# Altium schematic sheet Power1.SchDoc (part 2 of 2)
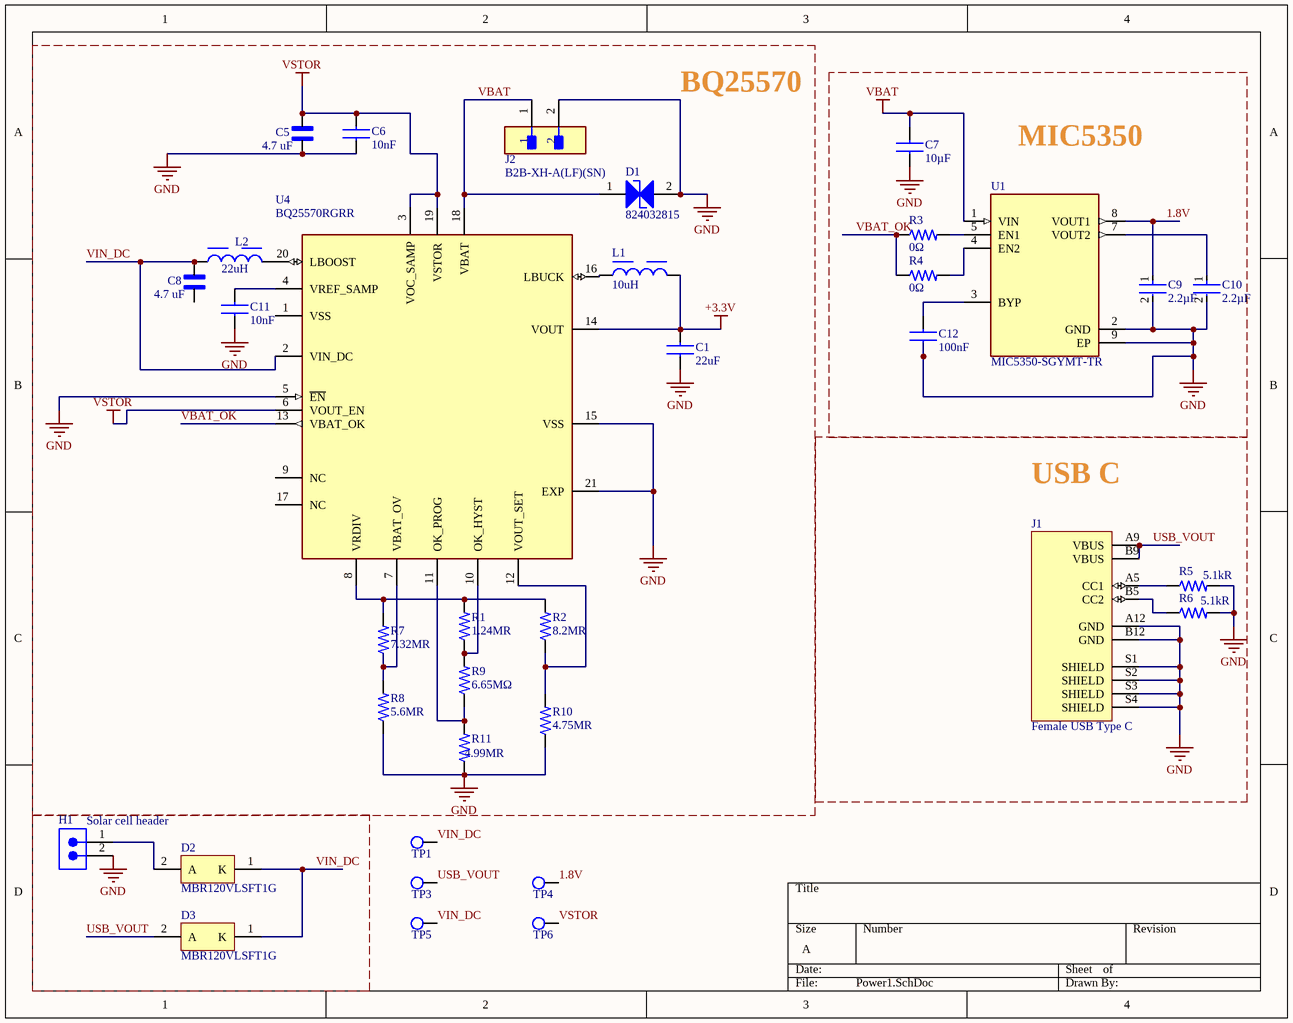
[diagram p1: Power1.SchDoc]

## Library data of the parts
C1 = GRM188R61A226ME15D: CAP CER 22UF 10V X5R 0603; Manufacturer: Murata; Voltage Rating DC: 10 VDC; Tolerance: 20 %; Brand: Murata Electronics; Type: Voltage and Temperature Derating Recommended Product; Unit Weight: 0.000222 oz; Supplier 1: Digi-Key; Supplier Part Number 1: 490-10476-1-ND; Manufacturer Part Number: GRM188R61A226ME15D; Stock 1: 849458; Pricing 1: 1=0.33, 10=0.226, 50=0.1506, 100=0.1279, 500=0.0903, 1000=0.079 (USD); Product Category: Multilayer Ceramic Capacitors MLCC - SMD/SMT; RoHS: True; Capacitance: 22 uF; Dielectric: X5R; Case Code - in: 0603; Case Code - mm: 1608; Height: 0.8 mm; Maximum Operating Temperature: + 85 C; Minimum Operating Temperature: - 55 C; Product: General Type MLCCs; Series: GRM; Packaging: Reel; Length: 1.6 mm; Package / Case: 0603 (1608 metric); Factory Pack Quantity: 4000; Termination Style: SMD/SMT; Width: 0.8 mm; ComponentLink1URL: http://www.farnell.com/datasheets/2047978.pdf?src-supplier=Element14; ComponentLink1Description: http://www.farnell.com/datasheets/2047978.pdf?src-supplier=Element14
C5 C8 = CL10A475KO8NNNC: 4.7 ÂµF Â±10% 16V Ceramic Capacitor X5R 0603 (1608 Metric); MF: Samsung Electro-Mechanics; SnapEDA_Link: https://www.snapeda.com/parts/CL10A475KO8NNNC/Samsung/view-part/?ref=snap; Package: SMD-2 Samsung; Value: *; MP: CL10A475KO8NNNC; Check_prices: https://www.snapeda.com/parts/CL10A475KO8NNNC/Samsung/view-part/?ref=eda
C6 C11 = CAP 10nF 0603: Multilayer Ceramic Capacitors MLCC - SMD/SMT 16V 0.01uF X7R 0603 10% AEC-Q200; Manufacturer: KEMET; Manufacturer Part Number: C0603C103K4RECAUTO; Supplier: Newark; Supplier Part Number: 76AH8427; RoHS: Compliant; Category: Ceramic Capacitors; Stock: 3130; Pricing: 1=0.02, 25=0.02, 50=0.02, 100=0.02, 250=0.02, 500=0.02, 1000=0.02 (USD); China RoHS: Compliant; Dielectric: X7R; Dielectric Material: Ceramic; Height: 800µm; Length: 1.6mm; Lifecycle Status: Production; Max Operating Temperature: 125°C; Min Operating Temperature: -55°C; Mounting Technology: Surface Mount; Number of Terminals: 2; REACH SVHC: Yes; Schedule B: 8532240020, 8532240020|8532240020, 8532240020|8532240020|8532240020, 8532240020|8532240020|8532240020|8532240020; Voltage Rating (DC): 16V; Width: 800µm; ComponentLink1URL: https://datasheet.octopart.com:443/C0603C103K4RECAUTO-KEMET-datasheet-178568699.pdf?src-supplier=IHS; ComponentLink1Description: https://datasheet.octopart.com:443/C0603C103K4RECAUTO-KEMET-datasheet-178568699.pdf?src-supplier=IHS; ComponentLink2URL: https://datasheet.octopart.com:443/C0603C103K4RECAUTO-KEMET-datasheet-189767465.pdf?src-supplier=ODG+(Origin+Data+Global); ComponentLink2Description: https://datasheet.octopart.com:443/C0603C103K4RECAUTO-KEMET-datasheet-189767465.pdf?src-supplier=ODG+(Origin+Data+Global); ComponentLink3URL: https://datasheet.octopart.com:443/C0603C103K4RECAUTO-KEMET-datasheet-149521825.pdf?src-supplier=Farnell; ComponentLink3Description: https://datasheet.octopart.com:443/C0603C103K4RECAUTO-KEMET-datasheet-149521825.pdf?src-supplier=Farnell; ComponentLink4URL: https://datasheet.octopart.com:443/C0603C103K4RECAUTO-KEMET-datasheet-153706760.pdf?src-supplier=Farnell; ComponentLink4Description: https://datasheet.octopart.com:443/C0603C103K4RECAUTO-KEMET-datasheet-153706760.pdf?src-supplier=Farnell; ComponentLink5URL: https://datasheet.octopart.com:443/C0603C103K4RECAUTO-KEMET-datasheet-153410967.pdf?src-supplier=Electro+Sonic; ComponentLink5Description: https://datasheet.octopart.com:443/C0603C103K4RECAUTO-KEMET-datasheet-153410967.pdf?src-supplier=Electro+Sonic; ComponentLink6URL: https://datasheet.octopart.com:443/C0603C103K4RECAUTO-KEMET-datasheet-176334325.pdf?src-supplier=Newark; ComponentLink6Description: https://datasheet.octopart.com:443/C0603C103K4RECAUTO-KEMET-datasheet-176334325.pdf?src-supplier=Newark; ComponentLink7URL: https://datasheet.octopart.com:443/C0603C103K4RECAUTO-KEMET-datasheet-158241778.pdf?src-supplier=TME; ComponentLink7Description: https://datasheet.octopart.com:443/C0603C103K4RECAUTO-KEMET-datasheet-158241778.pdf?src-supplier=TME; Supplier 1: DigiKey; Supplier Part Number 1: 399-17880-1-ND
C7 = CAP 10uF 0603: 10V 10uF X7R ±10% 0603 Multilayer Ceramic Capacitors MLCC - SMD/SMT ROHS; Manufacturer: Murata; Manufacturer Part Number: GRM188Z71A106KA73D; Manufacturer Lifecycle Status: IN PRODUCTION; Supplier: Avnet; Supplier Part Number: GRM188Z71A106KA73D; RoHS: Compliant; Category: Ceramic Capacitors; Stock: 36000; Pricing: 4000=0.04684, 8000=0.04661, 16000=0.04637, 24000=0.04613, 32000=0.04589 (USD); Case/Package: 0603; Dielectric Material: Ceramic; Height: 800µm; Length: 1.6mm; Lifecycle Status: Production; Material: Ceramic; Max Operating Temperature: 125°C; Min Operating Temperature: -55°C; Mounting Technology: Surface Mount; Number of Terminals: 2; REACH SVHC: Yes; Schedule B: 8532240020, 8532240020|8532240020|8532240020|8532240020|8532240020; Thickness: 800µm; Tolerance: 10%; Voltage Rating: 10V; Voltage Rating (DC): 10V; Width: 800µm; ComponentLink1URL: https://datasheet.octopart.com:443/GRM188Z71A106KA73D-Murata-datasheet-141276001.pdf?src-supplier=Geoflip; ComponentLink1Description: https://datasheet.octopart.com:443/GRM188Z71A106KA73D-Murata-datasheet-141276001.pdf?src-supplier=Geoflip; ComponentLink2URL: https://datasheet.octopart.com:443/GRM188Z71A106KA73D-Murata-datasheet-165579666.pdf?src-supplier=TME; ComponentLink2Description: https://datasheet.octopart.com:443/GRM188Z71A106KA73D-Murata-datasheet-165579666.pdf?src-supplier=TME; ComponentLink3URL: https://datasheet.octopart.com:443/GRM188Z71A106KA73D-Murata-datasheet-140705911.pdf?src-supplier=Ciiva; ComponentLink3Description: https://datasheet.octopart.com:443/GRM188Z71A106KA73D-Murata-datasheet-140705911.pdf?src-supplier=Ciiva; ComponentLink4URL: https://datasheet.octopart.com:443/GRM188Z71A106KA73D-Murata-datasheet-138743429.pdf?src-supplier=Ciiva; ComponentLink4Description: https://datasheet.octopart.com:443/GRM188Z71A106KA73D-Murata-datasheet-138743429.pdf?src-supplier=Ciiva; ComponentLink5URL: http://sigma.octopart.com:80/reach_statement/Murata-company-16.pdf?src-supplier=Compliance+Statements; ComponentLink5Description: http://sigma.octopart.com:80/reach_statement/Murata-company-16.pdf?src-supplier=Compliance+Statements; Supplier 1: DigiKey; Supplier Part Number 1: 490-GRM188Z71A106KA73DCT-ND
C9 C10 = CAP 2.2uF 0603: 10V 2.2uF X7R ±10% 0603 Multilayer Ceramic Capacitors MLCC - SMD/SMT ROHS; Manufacturer: Samsung Electro-Mechanics; Manufacturer Part Number: CL10B225KP8NNNC; Supplier: DigiKey; Supplier Part Number: 1276-1134-1-ND; RoHS: Compliant; Category: Ceramic Capacitors; Stock: 3647; Pricing: 1=0.08, 10=0.047, 50=0.0376, 100=0.028, 500=0.0224, 1000=0.02, 4000=0.0104 (USD); Case/Package: 0603; Case Code (Imperial): 0603; Case Code (Metric): 1608; China RoHS: Compliant; Contact Plating: Tin; Depth: 800µm; Dielectric: X7R; Dielectric Material: Ceramic; Height: 900µm; Length: 1.6mm; Lifecycle Status: Production; Material: Ceramic; Max Operating Temperature: 125°C; Min Operating Temperature: -55°C; Mounting Technology: Surface Mount; Number of Terminals: 2; Radiation Hardening: No; REACH SVHC: Yes; Schedule B: 8532240020, 8532240020|8532240020, 8532240020|8532240020|8532240020, 8532240020|8532240020|8532240020|8532240020; Thickness: 889µm; Tolerance: 10%; Voltage Rating: 10V; Voltage Rating (DC): 10V; Width: 800µm; ComponentLink1URL: https://datasheet.octopart.com:443/CL10B225KP8NNNC-Samsung-Electro-Mechanics-datasheet-182020320.pdf?src-supplier=IHS; ComponentLink1Description: https://datasheet.octopart.com:443/CL10B225KP8NNNC-Samsung-Electro-Mechanics-datasheet-182020320.pdf?src-supplier=IHS; ComponentLink2URL: https://datasheet.octopart.com:443/CL10B225KP8NNNC-Samsung-Electro-Mechanics-datasheet-136482340.pdf?src-supplier=Future+Electronics; ComponentLink2Description: https://datasheet.octopart.com:443/CL10B225KP8NNNC-Samsung-Electro-Mechanics-datasheet-136482340.pdf?src-supplier=Future+Electronics; ComponentLink3URL: https://datasheet.octopart.com:443/CL10B225KP8NNNC-Samsung-Electro-Mechanics-datasheet-116120883.pdf?src-supplier=Future+Electronics; ComponentLink3Description: https://datasheet.octopart.com:443/CL10B225KP8NNNC-Samsung-Electro-Mechanics-datasheet-116120883.pdf?src-supplier=Future+Electronics; ComponentLink4URL: https://datasheet.octopart.com:443/CL10B225KP8NNNC-Samsung-Electro-Mechanics-datasheet-81461883.pdf?src-supplier=Future+Electronics; ComponentLink4Description: https://datasheet.octopart.com:443/CL10B225KP8NNNC-Samsung-Electro-Mechanics-datasheet-81461883.pdf?src-supplier=Future+Electronics; ComponentLink5URL: https://datasheet.octopart.com:443/CL10B225KP8NNNC-Samsung-datasheet-26669043.pdf?src-supplier=Future+Electronics; ComponentLink5Description: https://datasheet.octopart.com:443/CL10B225KP8NNNC-Samsung-datasheet-26669043.pdf?src-supplier=Future+Electronics; ComponentLink6URL: https://datasheet.octopart.com:443/CL10B225KP8NNNC-Samsung-datasheet-12521702.pdf?src-supplier=Future+Electronics; ComponentLink6Description: https://datasheet.octopart.com:443/CL10B225KP8NNNC-Samsung-datasheet-12521702.pdf?src-supplier=Future+Electronics; ComponentLink7URL: https://datasheet.octopart.com:443/CL10B225KP8NNNC-Samsung-Electro-Mechanics-datasheet-149136832.pdf?src-supplier=Future+Electronics; ComponentLink7Description: https://datasheet.octopart.com:443/CL10B225KP8NNNC-Samsung-Electro-Mechanics-datasheet-149136832.pdf?src-supplier=Future+Electronics; ComponentLink8URL: https://datasheet.octopart.com:443/CL10B225KP8NNNC-Samsung-datasheet-37081328.pdf?src-supplier=Future+Electronics; ComponentLink8Description: https://datasheet.octopart.com:443/CL10B225KP8NNNC-Samsung-datasheet-37081328.pdf?src-supplier=Future+Electronics; ComponentLink9URL: https://datasheet.octopart.com/CL10B225KP8NNNC-Samsung-Electro-Mechanics-datasheet-97040617.pdf; ComponentLink9Description: https://datasheet.octopart.com/CL10B225KP8NNNC-Samsung-Electro-Mechanics-datasheet-97040617.pdf; ComponentLink10URL: https://datasheet.octopart.com/CL10B225KP8NNNC-Samsung-Electro-Mechanics-datasheet-8324245.pdf; ComponentLink10Description: https://datasheet.octopart.com/CL10B225KP8NNNC-Samsung-Electro-Mechanics-datasheet-8324245.pdf; ComponentLink11URL: https://datasheet.octopart.com:443/CL10B225KP8NNNC-Samsung-Electro-Mechanics-datasheet-11840088.pdf?src-supplier=Arrow+Electronics; ComponentLink11Description: https://datasheet.octopart.com:443/CL10B225KP8NNNC-Samsung-Electro-Mechanics-datasheet-11840088.pdf?src-supplier=Arrow+Electronics; ComponentLink12URL: https://datasheet.octopart.com:443/CL10B225KP8NNNC-Samsung-datasheet-59220082.pdf?src-supplier=TME; ComponentLink12Description: https://datasheet.octopart.com:443/CL10B225KP8NNNC-Samsung-datasheet-59220082.pdf?src-supplier=TME; Supplier 1: DigiKey; Supplier Part Number 1: 1276-1134-1-ND
C12 = CAP 0.1uF 0603: 0603 0.1 uF 10 V ±10% Tolerance X7R SMT Multilayer Ceramic Chip Capacitor; Manufacturer: Vishay; Manufacturer Part Number: VJ0603Y104KXQCW1BC; Voltage Rating (DC): 10V; Supplier: Newark; Supplier Part Number: 77AK2911; RoHS: Compliant; Category: Ceramic Capacitors; Stock: 20000; Pricing: 4000=0.028, 8000=0.026 (USD); Case/Package: 0603; Case Code (Imperial): 0603; Case Code (Metric): 1608; China RoHS: Compliant; Depth: 800µm; Dielectric: X7R; Dielectric Material: Ceramic; Height: 870µm; Lead Free: Lead Free; Length: 1.6mm; Lifecycle Status: Production; Max Operating Temperature: 125°C; Min Operating Temperature: -55°C; Mounting Technology: Surface Mount; Number of Terminals: 2; REACH SVHC: Yes; Schedule B: 8532240020, 8532240020|8532240020|8532240020|8532240020|8532240020; Termination: SMD/SMT; Tolerance: 10%; Width: 800µm; ComponentLink1URL: https://datasheet.octopart.com:443/VJ0603Y104KXQCW1BC-Vishay-datasheet-182138897.pdf?src-supplier=IHS; ComponentLink1Description: https://datasheet.octopart.com:443/VJ0603Y104KXQCW1BC-Vishay-datasheet-182138897.pdf?src-supplier=IHS; ComponentLink2URL: https://datasheet.octopart.com:443/VJ0603Y104KXQCW1BC-Vishay-datasheet-182137611.pdf?src-supplier=IHS; ComponentLink2Description: https://datasheet.octopart.com:443/VJ0603Y104KXQCW1BC-Vishay-datasheet-182137611.pdf?src-supplier=IHS; ComponentLink3URL: https://datasheet.octopart.com:443/VJ0603Y104KXQCW1BC-Vishay-datasheet-79783898.pdf?src-supplier=Future+Electronics; ComponentLink3Description: https://datasheet.octopart.com:443/VJ0603Y104KXQCW1BC-Vishay-datasheet-79783898.pdf?src-supplier=Future+Electronics; ComponentLink4URL: https://datasheet.octopart.com/VJ0603Y104KXQCW1BC-Vishay-datasheet-13530908.pdf; ComponentLink4Description: https://datasheet.octopart.com/VJ0603Y104KXQCW1BC-Vishay-datasheet-13530908.pdf; ComponentLink5URL: https://datasheet.octopart.com/VJ0603Y104KXQCW1BC-Vishay-datasheet-13436109.pdf; ComponentLink5Description: https://datasheet.octopart.com/VJ0603Y104KXQCW1BC-Vishay-datasheet-13436109.pdf; ComponentLink6URL: https://datasheet.octopart.com/VJ0603Y104KXQCW1BC-Vishay-datasheet-13168783.pdf; ComponentLink6Description: https://datasheet.octopart.com/VJ0603Y104KXQCW1BC-Vishay-datasheet-13168783.pdf; ComponentLink7URL: https://datasheet.octopart.com/VJ0603Y104KXQCW1BC-Vishay-datasheet-13134009.pdf; ComponentLink7Description: https://datasheet.octopart.com/VJ0603Y104KXQCW1BC-Vishay-datasheet-13134009.pdf; ComponentLink8URL: https://datasheet.octopart.com/VJ0603Y104KXQCW1BC-Vishay-datasheet-13055807.pdf; ComponentLink8Description: https://datasheet.octopart.com/VJ0603Y104KXQCW1BC-Vishay-datasheet-13055807.pdf; ComponentLink9URL: https://datasheet.octopart.com/VJ0603Y104KXQCW1BC-Vishay-datasheet-13029350.pdf; ComponentLink9Description: https://datasheet.octopart.com/VJ0603Y104KXQCW1BC-Vishay-datasheet-13029350.pdf; ComponentLink10URL: https://datasheet.octopart.com/VJ0603Y104KXQCW1BC-Vishay-datasheet-12584848.pdf; ComponentLink10Description: https://datasheet.octopart.com/VJ0603Y104KXQCW1BC-Vishay-datasheet-12584848.pdf; ComponentLink11URL: https://datasheet.octopart.com/VJ0603Y104KXQCW1BC-Vishay-datasheet-12543093.pdf; ComponentLink11Description: https://datasheet.octopart.com/VJ0603Y104KXQCW1BC-Vishay-datasheet-12543093.pdf; ComponentLink12URL: https://datasheet.octopart.com/VJ0603Y104KXQCW1BC-Vishay-datasheet-12532924.pdf; ComponentLink12Description: https://datasheet.octopart.com/VJ0603Y104KXQCW1BC-Vishay-datasheet-12532924.pdf; ComponentLink13URL: https://datasheet.octopart.com/VJ0603Y104KXQCW1BC-Vishay-datasheet-12519409.pdf; ComponentLink13Description: https://datasheet.octopart.com/VJ0603Y104KXQCW1BC-Vishay-datasheet-12519409.pdf; ComponentLink14URL: https://datasheet.octopart.com/VJ0603Y104KXQCW1BC-Vishay-datasheet-12509873.pdf; ComponentLink14Description: https://datasheet.octopart.com/VJ0603Y104KXQCW1BC-Vishay-datasheet-12509873.pdf; ComponentLink15URL: http://sigma.octopart.com:80/rohs_statement/Vishay-company-15.pdf?src-supplier=Compliance+Statements; ComponentLink15Description: http://sigma.octopart.com:80/rohs_statement/Vishay-company-15.pdf?src-supplier=Compliance+Statements; Supplier 1: DigiKey; Supplier Part Number 1: 720-1689-1-ND
D1 = TVS Diode ESD Protection: 824032815 Tvs Diode, Bidir, 5V, Dfn1610 Rohs Compliant: Yes |Wurth Elektronik 824032815; NexarPartId: 133963841; Min Operating Temperature: -55°C; Width: 1mm; Length: 1.6mm; RoHS: Compliant; Max Operating Temperature: 85°C; Height: 500µm
D2 D3 = Diode Schottky: Schottky Power Rectifier, 2-Pin SOD-123, Pb-Free, Tape and Reel; Manufacturer: On Semiconductor; IFSM Max (A): 45; Configuration: Single; PackageDescription: 2-Pin SOD, Body 1.65 x 2.7 mm; RoHS: TRUE; ComponentLink2URL: http://www.onsemi.cn/pub_link/Collateral/MBR120VLSFT1-D.PDF; Mounting Technology: Surface Mount; ComponentLink1Description: Manufacturer URL; DatasheetVersion: Rev. 2; ComponentLink3Description: Package Specification; Packing: Tape and Reel; ComponentLink2Description: Datasheet; ComponentLink1URL: http://www.onsemi.com/; PackageVersion: Rev. A; PackageReference: SOD-123FL-2-498-01; ComponentLink3URL: http://www.onsemi.cn/pub_link/Collateral/MBR120VLSFT1-D.PDF; PartNumber: MBR120VLSFT1G
H1 = SOLAR_CELL: CONN HEADER VERT 2POS 2.54MM; Manufacturer: Sullins; Manufacturer Part Number: PRPC002SAAN-RC; Connector Type: Header, Unshrouded, Breakaway; Number of Positions: 2; Number of Positions Loaded: All; Pitch: 0.100" (2.54mm); Online Catalog: 0.100" (2.54mm) Pitch Connector Headers; Other Names: S9510E-02  S9510E-02-ND; Supplier 1: Digi-Key; Stock 1: 42739; Pricing 1: 1=0.08, 10=0.073, 25=0.054, 50=0.0464, 100=0.0449, 250=0.0387, 500=0.0372 (USD); Standard Package: 1; Category: Connectors, Interconnects; Family: Rectangular Connectors - Headers, Male Pins; Series: -; Packaging: Bulk; Contact Type: Male Pin; Number of Rows: 1; Row Spacing: -; Contact Mating Length: 0.230" (5.84mm); Mounting Type: Through Hole; Termination: Solder; Fastening Type: -; Features: -; Contact Finish: Gold; Contact Finish Thickness: Flash; Color: Black; ComponentLink1URL: https://media.digikey.com/PDF/Data%20Sheets/Sullins%20PDFs/xRxCzzzSxxN-RC_ST_11635-B.pdf?src-supplier=Digi-Key; ComponentLink1Description: https://media.digikey.com/PDF/Data%20Sheets/Sullins%20PDFs/xRxCzzzSxxN-RC_ST_11635-B.pdf?src-supplier=Digi-Key; Supplier Part Number 1: S1011EC-02-ND
J1 = USB-C Power Connector: USB-C (USB TYPE-C) Receptacle Connector 24 (6+18 Dummy) Position Surface Mount, Right Angle; Through Hole; Manufacturer Part Number: USB4125-GF-A_REVA2; Package: None; Availability: Unavailable; Value: *; Price: None
J2 = CMP-2000-05888-3: CONN HEADER VERT 2POS 2.5MM; Current Rating: 3A; Voltage Rating: 250V; Number of Contacts: 2; Contact Resistance: 20mR; Wire/Cable Gauge: 22AWG; Insulation Resistance: 1GR; Connector Type: Male Pin; Packaging: Bulk; Contact Material: Brass; Lead Free: Lead Free; Orientation: Straight; Contact Plating: Tin; Max Current Rating: 3A; Termination: Solder; Fastening Type: Detent; Depth: 5.75mm; Housing Material: Polyamide; REACH SVHC: No SVHC; Series: XH; Voltage Rating (AC): 250V; Number of Positions: 2; Color: Natural; Contact Type: Male Pin; Max Voltage Rating (DC): 250V; Pitch: 2.5mm; Lead Pitch: 2.5mm; Mount: Through Hole; Max Operating Temperature: 85°C; Length: 7.4mm; Max Voltage Rating (AC): 250V; Min Operating Temperature: -25°C; Number of Rows: 1; Housing Color: White; Supplier 1: Mouser; Supplier Part Number 1: 306-B2BXHALFSNP
L1 = CMP-0227-00077-3: 10 µH Shielded Drum Core, Wirewound Inductor 650 mA 470mOhm Max Nonstandard; NexarPartId: 8917062; Tolerance: 30%; Saturation Current: 500mA; Series Resistance: 300mΩ; Core Material: Ferrite; Resistance: 390mΩ; Max DC Current: 800mA; Inductance: 10µH; Self Resonant Frequency: 40MHz; Test Frequency: 100kHz; RMS Current (Irms): 650mA; Min Operating Temperature: -40°C; Mount: Surface Mount; Height - Seated (Max): 1.4986mm; Width: 2.78mm; Shielding: Shielded; Number of Pins: 2; Ambient Temperature Range High: 85°C; Lead Free: Lead Free; Case/Package: Nonstandard; Weight: 32.006612mg; REACH SVHC: Unknown; Depth: 2.8mm; Height: 1.35mm; Length: 2.78mm; RoHS: Compliant; Max Operating Temperature: 125°C; DC Resistance (DCR): 390mΩ; Inductance Tolerance: 30%; Composition: Wirewound; Current Rating: 650mA; Ambient Temperature Range Low: -40°C; Termination: SMD/SMT; Packaging: Cut Tape (CT); Supplier 1: Newark; Supplier Part Number 1: 08P2467
L2 = CMP-0227-00346-4: 22 µH Shielded Drum Core, Wirewound Inductor 510 mA 450mOhm Max Nonstandard; NexarPartId: 22866169; Series Resistance: 450mΩ; Self Resonant Frequency: 26MHz; Core Material: Ferrite; Current Rating: 510mA; Test Frequency: 100kHz; Tolerance: 30%; Saturation Current: 360mA; Inductance: 22µH; DC Resistance (DCR): 410mΩ; Width: 3.8mm; Ambient Temperature Range High: 95°C; Number of Pins: 2; Ambient Temperature Range Low: -40°C; Min Operating Temperature: -40°C; Packaging: Tape & Reel (TR); Height: 1.65mm; RoHS: Compliant; Composition: Wirewound; RMS Current (Irms): 510mA; Max Operating Temperature: 125°C; Inductance Tolerance: 30%; Length: 3.8mm
R1 = RES 1.24M 0603: Fixed Resistor, Metal Glaze/thick Film, 0.1W, 1240000ohm, 75V, 1% +/-Tol, 100ppm/Cel, Surface Mount, 0603; Manufacturer: Yageo; Manufacturer Part Number: RC0603FR-071M24L; Additional Feature: LASER TRIMMABLE; Power: 100mW; Rated Temperature: 70°C; Temperature Coefficient: 100ppm/°C; Package Height: 0.45mm; Package Length: 1.6mm; Package Width: 0.8mm; Supplier: Digikey; Supplier Part Number: 13-RC0603FR-071M24LCT-ND; RoHS: Yes; Category: Chip SMD Resistors; Stock: 7097; Pricing: 1=0.1, 10=0.019, 50=0.0112, 100=0.0093, 500=0.00622, 1000=0.00532 (USD); Mounting Technology: Surface Mount; Pins: 2; Package Shape: Rectangular; Case/Package: 0603; Terminal Finish: Nickel; Min Operating Temperature: -55°C; Max Operating Temperature: 155°C; Tolerance: 1%; JESD-609 Code: e3; Resistor Type: FIXED RESISTOR; Construction: Chip; Package Style: SMTMeter; Packaging: Tape and Reel; Technology: METAL GLAZE/THICK FILM; Termination: Wraparound; Working Voltage: 75V; Reach SVHC Compliant: Yes; RoHS Compliant: Yes; ComponentLink1URL: https://datasheet.ciiva.com:443/pdfs/VipMasterIC/IC/YAGO/YAGO-S-A0008145938/YAGO-S-A0008145938-1.pdf?src-supplier=IHS+Markit; ComponentLink1Description: https://datasheet.ciiva.com:443/pdfs/VipMasterIC/IC/YAGO/YAGO-S-A0008145938/YAGO-S-A0008145938-1.pdf?src-supplier=IHS+Markit; ComponentLink2URL: http://www.mouser.com/ds/2/447/RC0603-272842.pdf?src-supplier=Mouser; ComponentLink2Description: http://www.mouser.com/ds/2/447/RC0603-272842.pdf?src-supplier=Mouser; ComponentLink3URL: http://www.yageo.com/documents/recent/PYu-RC_Group_51_RoHS_L_2.pdf?src-supplier=Avnet; ComponentLink3Description: http://www.yageo.com/documents/recent/PYu-RC_Group_51_RoHS_L_2.pdf?src-supplier=Avnet; ComponentLink4URL: http://www.yageo.com.tw/exep/pages/download/literatures/PYu-R_INT-thick_7.pdf?src-supplier=Digikey; ComponentLink4Description: http://www.yageo.com.tw/exep/pages/download/literatures/PYu-R_INT-thick_7.pdf?src-supplier=Digikey; ComponentLink5URL: https://datasheet.octopart.com/RC0603FR-071M24L-Yageo-datasheet-164759695.pdf?src-supplier=Future+Electronics; ComponentLink5Description: https://datasheet.octopart.com/RC0603FR-071M24L-Yageo-datasheet-164759695.pdf?src-supplier=Future+Electronics; Supplier 1: DigiKey; Supplier Part Number 1: 541-1.24MHDKR-ND
R2 = RES 8.2M 0603: Fixed Resistor, Metal Glaze/thick Film, 0.1W, 8200000ohm, 75V, 5% +/-Tol, 100ppm/Cel, Surface Mount, 0603; Manufacturer: Yageo; Manufacturer Part Number: RC0603JR-078M2L; Additional Feature: LASER TRIMMABLE; Power: 100mW; Rated Temperature: 70°C; Temperature Coefficient: 100ppm/°C; Package Height: 0.45mm; Package Length: 1.6mm; Package Width: 0.8mm; Supplier: Digikey; Supplier Part Number: 311-8.2MGRCT-ND; RoHS: Yes; Category: Chip SMD Resistors; Stock: 33026; Pricing: 1=0.1, 10=0.01, 50=0.0082, 100=0.0061, 500=0.0056, 1000=0.0051 (USD); Mounting Technology: Surface Mount; Pins: 2; Package Shape: Rectangular; Case/Package: 0603; Terminal Finish: Nickel; Min Operating Temperature: -55°C; Max Operating Temperature: 155°C; Tolerance: 5%; JESD-609 Code: e3; Resistor Type: FIXED RESISTOR; Construction: Chip; Package Style: SMTMeter; Packaging: Tape and Reel; Technology: METAL GLAZE/THICK FILM; Termination: Wraparound; Working Voltage: 75V; Reach SVHC Compliant: Yes; RoHS Compliant: Yes; ComponentLink1URL: https://datasheet.ciiva.com:443/pdfs/VipMasterIC/IC/YAGO/YAGO-S-A0008145938/YAGO-S-A0008145938-1.pdf?src-supplier=IHS+Markit; ComponentLink1Description: https://datasheet.ciiva.com:443/pdfs/VipMasterIC/IC/YAGO/YAGO-S-A0008145938/YAGO-S-A0008145938-1.pdf?src-supplier=IHS+Markit; ComponentLink2URL: https://datasheet.ciiva.com/12561/rc0603-272842-12561446.pdf?src-supplier=Mouser; ComponentLink2Description: https://datasheet.ciiva.com/12561/rc0603-272842-12561446.pdf?src-supplier=Mouser; ComponentLink3URL: https://datasheet.ciiva.com/2453/pyu-r-int-thick-7-2453229.pdf?src-supplier=Digikey; ComponentLink3Description: https://datasheet.ciiva.com/2453/pyu-r-int-thick-7-2453229.pdf?src-supplier=Digikey; ComponentLink4URL: https://datasheet.ciiva.com/2453/pyu-r-int-thick-7-2453230.pdf?src-supplier=Digikey; ComponentLink4Description: https://datasheet.ciiva.com/2453/pyu-r-int-thick-7-2453230.pdf?src-supplier=Digikey; ComponentLink5URL: https://datasheet.ciiva.com/2453/pyu-r-int-thick-7-2453231.pdf?src-supplier=Digikey; ComponentLink5Description: https://datasheet.ciiva.com/2453/pyu-r-int-thick-7-2453231.pdf?src-supplier=Digikey; Supplier 1: DigiKey; Supplier Part Number 1: 13-RC0603FR-078M2LCT-ND
R3 R4 = RES 0R 0603: GENERAL PURPOSE CHIP RESISTOR Metal Glaze/thick Film, 0.1W, 0ohm, Surface Mount, 0603; Manufacturer: Yageo Group; Manufacturer Part Number: RC0603JR-070RL; Power Dissipation: 100mW; Temperature Coefficient: 200ppm/°C; Tolerance: 1%; Voltage Rating: 50V; Supplier: Newark; Supplier Part Number: 68X3182; RoHS: Compliant; Category: Chip SMD Resistors; Stock: 1605000; Pricing: 5000=0.003 (USD); Case/Package: 0603; Case Code (Imperial): 0603; China RoHS: Non-Compliant; Composition: Thick Film; Contact Plating: Tin; Depth: 800µm; Height: 450µm; Lead Free: Lead Free; Length: 1.6mm; Lifecycle Status: Production; Max Operating Temperature: 155°C; Military Standard: Not; Min Operating Temperature: -55°C; Mounting Technology: Surface Mount; Pins: 2; Number of Terminals: 2; Packaging: Cut Tape; Power Rating: 100mW; Radiation Hardening: No; REACH SVHC: Yes; Termination: SMD/SMT; Voltage Rating (DC): 50V; Width: 800µm; ComponentLink1URL: https://datasheet.octopart.com:443/RC0603JR-070RL-Yageo-datasheet-182189538.pdf?src-supplier=IHS; ComponentLink1Description: https://datasheet.octopart.com:443/RC0603JR-070RL-Yageo-datasheet-182189538.pdf?src-supplier=IHS; ComponentLink2URL: https://datasheet.octopart.com:443/RC0603JR-070RL-Yageo-datasheet-8328172.pdf?src-supplier=element14+APAC; ComponentLink2Description: https://datasheet.octopart.com:443/RC0603JR-070RL-Yageo-datasheet-8328172.pdf?src-supplier=element14+APAC; ComponentLink3URL: https://datasheet.octopart.com:443/RC0603JR-070RL-Yageo-datasheet-17842380.pdf?src-supplier=element14+APAC; ComponentLink3Description: https://datasheet.octopart.com:443/RC0603JR-070RL-Yageo-datasheet-17842380.pdf?src-supplier=element14+APAC; ComponentLink4URL: https://datasheet.octopart.com:443/RC0603JR-070RL-Yageo-datasheet-62067350.pdf?src-supplier=Farnell; ComponentLink4Description: https://datasheet.octopart.com:443/RC0603JR-070RL-Yageo-datasheet-62067350.pdf?src-supplier=Farnell; ComponentLink5URL: https://datasheet.octopart.com:443/RC0603JR-070RL-Yageo-datasheet-15599030.pdf?src-supplier=Future+Electronics; ComponentLink5Description: https://datasheet.octopart.com:443/RC0603JR-070RL-Yageo-datasheet-15599030.pdf?src-supplier=Future+Electronics; ComponentLink6URL: https://datasheet.octopart.com:443/RC0603JR-070RL-Yageo-datasheet-164759695.pdf?src-supplier=Future+Electronics; ComponentLink6Description: https://datasheet.octopart.com:443/RC0603JR-070RL-Yageo-datasheet-164759695.pdf?src-supplier=Future+Electronics; ComponentLink7URL: https://datasheet.octopart.com:443/RC0603JR-070RL-Yageo-datasheet-137700087.pdf?src-supplier=Future+Electronics; ComponentLink7Description: https://datasheet.octopart.com:443/RC0603JR-070RL-Yageo-datasheet-137700087.pdf?src-supplier=Future+Electronics; ComponentLink8URL: https://datasheet.octopart.com:443/RC0603JR-070RL-Yageo-datasheet-27584510.pdf?src-supplier=Future+Electronics; ComponentLink8Description: https://datasheet.octopart.com:443/RC0603JR-070RL-Yageo-datasheet-27584510.pdf?src-supplier=Future+Electronics; ComponentLink9URL: https://datasheet.octopart.com:443/RC0603JR-070RL-Yageo-datasheet-503470.pdf?src-supplier=Future+Electronics; ComponentLink9Description: https://datasheet.octopart.com:443/RC0603JR-070RL-Yageo-datasheet-503470.pdf?src-supplier=Future+Electronics; ComponentLink10URL: https://datasheet.octopart.com:443/RC0603JR-070RL-Yageo-datasheet-12596169.pdf?src-supplier=Newark; ComponentLink10Description: https://datasheet.octopart.com:443/RC0603JR-070RL-Yageo-datasheet-12596169.pdf?src-supplier=Newark; ComponentLink11URL: https://datasheet.octopart.com:443/RC0603JR-070RL-Yageo-datasheet-34211833.pdf?src-supplier=Newark; ComponentLink11Description: https://datasheet.octopart.com:443/RC0603JR-070RL-Yageo-datasheet-34211833.pdf?src-supplier=Newark; ComponentLink12URL: https://datasheet.octopart.com:443/RC0603JR-070RL-Yageo-datasheet-79472498.pdf?src-supplier=Megastar; ComponentLink12Description: https://datasheet.octopart.com:443/RC0603JR-070RL-Yageo-datasheet-79472498.pdf?src-supplier=Megastar; ComponentLink13URL: https://datasheet.octopart.com/RC0603JR-070RL-Yageo-datasheet-73766026.pdf; ComponentLink13Description: https://datasheet.octopart.com/RC0603JR-070RL-Yageo-datasheet-73766026.pdf; ComponentLink14URL: https://datasheet.octopart.com:443/RC0603JR-070RL-Yageo-datasheet-5393049.pdf?src-supplier=element14; ComponentLink14Description: https://datasheet.octopart.com:443/RC0603JR-070RL-Yageo-datasheet-5393049.pdf?src-supplier=element14; ComponentLink15URL: https://datasheet.octopart.com:443/RC0603JR-070RL-Yageo-datasheet-118562.pdf?src-supplier=DigiKey; ComponentLink15Description: https://datasheet.octopart.com:443/RC0603JR-070RL-Yageo-datasheet-118562.pdf?src-supplier=DigiKey; ComponentLink16URL: http://sigma.octopart.com:80/rohs_statement/Yageo-company-2.pdf?src-supplier=Compliance+Statements; ComponentLink16Description: http://sigma.octopart.com:80/rohs_statement/Yageo-company-2.pdf?src-supplier=Compliance+Statements; ComponentLink17URL: http://sigma.octopart.com:80/conflict_mineral_statement/Yageo-company-3.pdf?src-supplier=Compliance+Statements; ComponentLink17Description: http://sigma.octopart.com:80/conflict_mineral_statement/Yageo-company-3.pdf?src-supplier=Compliance+Statements
R5 R6 = RES 5.1K 0603: Fixed Resistor, Metal Glaze/thick Film, 0.1W, 5100ohm, 75V, 1% +/-Tol, 100ppm/Cel, Surface Mount, 0603; Manufacturer: Yageo; Manufacturer Part Number: RC0603FR-075K1L; Additional Feature: LASER TRIMMABLE; Power: 100mW; Rated Temperature: 70°C; Temperature Coefficient: 100ppm/°C; Package Height: 0.45mm; Package Length: 1.6mm; Package Width: 0.8mm; Supplier: Digikey; Supplier Part Number: 311-5.10KHRCT-ND; RoHS: Yes; Category: Chip SMD Resistors; Stock: 2084844; Pricing: 1=0.1, 10=0.019, 50=0.0112, 100=0.0093, 500=0.00622, 1000=0.00532, 5000=0.00382, 10000=0.00335, 25000=0.00287, 35000=0.00278, 50000=0.00257, 125000=0.00232 (USD); Mounting Technology: Surface Mount; Pins: 2; Package Shape: Rectangular; Case/Package: 0603; Terminal Finish: Nickel; Min Operating Temperature: -55°C; Max Operating Temperature: 155°C; Tolerance: 1%; JESD-609 Code: e3; Resistor Type: FIXED RESISTOR; Construction: Chip; Package Style: SMTMeter; Packaging: Tape and Reel; Technology: METAL GLAZE/THICK FILM; Termination: Wraparound; Working Voltage: 75V; Reach SVHC Compliant: Yes; RoHS Compliant: Yes; ComponentLink1URL: https://datasheet.ciiva.com:443/pdfs/VipMasterIC/IC/YAGO/YAGO-S-A0008145938/YAGO-S-A0008145938-1.pdf?src-supplier=IHS+Markit; ComponentLink1Description: https://datasheet.ciiva.com:443/pdfs/VipMasterIC/IC/YAGO/YAGO-S-A0008145938/YAGO-S-A0008145938-1.pdf?src-supplier=IHS+Markit; ComponentLink2URL: https://datasheet.ciiva.com/46395/443971-46395016.pdf?src-supplier=Element14; ComponentLink2Description: https://datasheet.ciiva.com/46395/443971-46395016.pdf?src-supplier=Element14; ComponentLink3URL: https://datasheet.ciiva.com/2454/pyu-r-int-thick-7-2454045.pdf?src-supplier=Digikey; ComponentLink3Description: https://datasheet.ciiva.com/2454/pyu-r-int-thick-7-2454045.pdf?src-supplier=Digikey; ComponentLink4URL: https://datasheet.ciiva.com/2454/pyu-r-int-thick-7-2454046.pdf?src-supplier=Digikey; ComponentLink4Description: https://datasheet.ciiva.com/2454/pyu-r-int-thick-7-2454046.pdf?src-supplier=Digikey; ComponentLink5URL: https://datasheet.ciiva.com/2454/pyu-r-int-thick-7-2454047.pdf?src-supplier=Digikey; ComponentLink5Description: https://datasheet.ciiva.com/2454/pyu-r-int-thick-7-2454047.pdf?src-supplier=Digikey; ComponentLink6URL: https://datasheet.ciiva.com/15189/getdatasheetpartid-326732-15189786.pdf?src-supplier=Verical; ComponentLink6Description: https://datasheet.ciiva.com/15189/getdatasheetpartid-326732-15189786.pdf?src-supplier=Verical
R7 = RES 7.32M 0603: Fixed Resistor, Metal Glaze/thick Film, 0.1W, 7320000ohm, 75V, 1% +/-Tol, 100ppm/Cel, Surface Mount, 0603; Manufacturer: Yageo; Manufacturer Part Number: RC0402FR-077M32L; Additional Feature: LASER TRIMMABLE; Power: 62.5mW; Rated Temperature: 70°C; Temperature Coefficient: 100ppm/°C; Working Voltage: 50V; Package Height: 0.35mm; Package Length: 1mm; Package Width: 0.5mm; Reference Standard: AEC-Q200; Supplier: Digikey; Supplier Part Number: 13-RC0402FR-077M32LCT-ND; RoHS: Yes; Category: Chip SMD Resistors; Stock: 49586; Pricing: 1=0.1, 10=0.015, 50=0.0088, 100=0.0073, 500=0.00488, 1000=0.00417, 5000=0.00297 (USD); Mounting Technology: Surface Mount; Pins: 2; Package Shape: Rectangular; Case/Package: 0402; Terminal Finish: Nickel; Min Operating Temperature: -55°C; Max Operating Temperature: 155°C; Tolerance: 1%; JESD-609 Code: e3; Resistor Type: FIXED RESISTOR; Construction: Chip; Package Style: SMTMeter; Packaging: Tape and Reel; Technology: METAL GLAZE/THICK FILM; Termination: Wraparound; Reach SVHC Compliant: Yes; RoHS Compliant: Yes; ComponentLink1URL: https://datasheet.ciiva.com:443/pdfs/VipMasterIC/IC/YAGO/YAGO-S-A0008145938/YAGO-S-A0008145938-1.pdf?src-supplier=IHS+Markit; ComponentLink1Description: https://datasheet.ciiva.com:443/pdfs/VipMasterIC/IC/YAGO/YAGO-S-A0008145938/YAGO-S-A0008145938-1.pdf?src-supplier=IHS+Markit; ComponentLink2URL: http://www.mouser.com/ds/2/447/PYu-RC0402_51_RoHS_L_6_r-8721.pdf?src-supplier=Mouser; ComponentLink2Description: http://www.mouser.com/ds/2/447/PYu-RC0402_51_RoHS_L_6_r-8721.pdf?src-supplier=Mouser; ComponentLink3URL: http://www.yageo.com.tw/exep/pages/download/literatures/PYu-R_INT-thick_7.pdf?src-supplier=Digikey; ComponentLink3Description: http://www.yageo.com.tw/exep/pages/download/literatures/PYu-R_INT-thick_7.pdf?src-supplier=Digikey; ComponentLink4URL: http://www.yageo.com/documents/recent/PYu-RC0402_51_RoHS_L_6.pdf?src-supplier=Avnet; ComponentLink4Description: http://www.yageo.com/documents/recent/PYu-RC0402_51_RoHS_L_6.pdf?src-supplier=Avnet; ComponentLink5URL: https://datasheet.octopart.com/RC0402FR-077M32L-Yageo-datasheet-164759695.pdf?src-supplier=Future+Electronics; ComponentLink5Description: https://datasheet.octopart.com/RC0402FR-077M32L-Yageo-datasheet-164759695.pdf?src-supplier=Future+Electronics; ComponentLink6URL: https://datasheet.ciiva.com:443/pdfs/VipMasterIC/IC/VISH/VISH-S-A0007266705/VISH-S-A0007266705-1.pdf?src-supplier=IHS+Markit; ComponentLink6Description: https://datasheet.ciiva.com:443/pdfs/VipMasterIC/IC/VISH/VISH-S-A0007266705/VISH-S-A0007266705-1.pdf?src-supplier=IHS+Markit; ComponentLink7URL: https://datasheet.ciiva.com/22676/1700796-22676479.pdf?src-supplier=Element14; ComponentLink7Description: https://datasheet.ciiva.com/22676/1700796-22676479.pdf?src-supplier=Element14; ComponentLink8URL: https://datasheet.ciiva.com/5588/dcrcwe3-109170-5588998.pdf?src-supplier=Mouser; ComponentLink8Description: https://datasheet.ciiva.com/5588/dcrcwe3-109170-5588998.pdf?src-supplier=Mouser; ComponentLink9URL: https://datasheet.ciiva.com/2525/dcrcwe3-2525464.pdf?src-supplier=Digikey; ComponentLink9Description: https://datasheet.ciiva.com/2525/dcrcwe3-2525464.pdf?src-supplier=Digikey; ComponentLink10URL: https://datasheet.ciiva.com/2525/dcrcwe3-2525465.pdf?src-supplier=Digikey; ComponentLink10Description: https://datasheet.ciiva.com/2525/dcrcwe3-2525465.pdf?src-supplier=Digikey; ComponentLink11URL: https://datasheet.ciiva.com/2525/dcrcwe3-2525466.pdf?src-supplier=Digikey; ComponentLink11Description: https://datasheet.ciiva.com/2525/dcrcwe3-2525466.pdf?src-supplier=Digikey
R8 = RES 5.62M 0603: Fixed Resistor, Metal Glaze/thick Film, 0.1W, 5620000ohm, 75V, 1% +/-Tol, 100ppm/Cel, Surface Mount, 0603; Manufacturer: Yageo; Manufacturer Part Number: RC0603JR-075M6L; Tolerance: 5%; Additional Feature: LASER TRIMMABLE; Power: 100mW; Rated Temperature: 70°C; Temperature Coefficient: 100ppm/°C; Package Height: 0.45mm; Package Length: 1.6mm; Package Width: 0.8mm; Supplier: Digikey; Supplier Part Number: 311-5.6MGRCT-ND; RoHS: Yes; Category: Chip SMD Resistors; Stock: 110556; Pricing: 1=0.1, 10=0.015, 50=0.0092, 100=0.0076, 500=0.00512, 1000=0.00437 (USD); Mounting Technology: Surface Mount; Pins: 2; Package Shape: Rectangular; Case/Package: 0603; Terminal Finish: Nickel; Min Operating Temperature: -55°C; Max Operating Temperature: 155°C; JESD-609 Code: e3; Resistor Type: FIXED RESISTOR; Construction: Chip; Package Style: SMTMeter; Packaging: Tape and Reel; Technology: METAL GLAZE/THICK FILM; Termination: Wraparound; Working Voltage: 75V; Reach SVHC Compliant: Yes; RoHS Compliant: Yes; ComponentLink1URL: https://datasheet.ciiva.com:443/pdfs/VipMasterIC/IC/YAGO/YAGO-S-A0008145938/YAGO-S-A0008145938-1.pdf?src-supplier=IHS+Markit; ComponentLink1Description: https://datasheet.ciiva.com:443/pdfs/VipMasterIC/IC/YAGO/YAGO-S-A0008145938/YAGO-S-A0008145938-1.pdf?src-supplier=IHS+Markit; ComponentLink2URL: https://datasheet.ciiva.com/2453/pyu-r-int-thick-7-2453118.pdf?src-supplier=Digikey; ComponentLink2Description: https://datasheet.ciiva.com/2453/pyu-r-int-thick-7-2453118.pdf?src-supplier=Digikey; ComponentLink3URL: https://datasheet.ciiva.com/2453/pyu-r-int-thick-7-2453119.pdf?src-supplier=Digikey; ComponentLink3Description: https://datasheet.ciiva.com/2453/pyu-r-int-thick-7-2453119.pdf?src-supplier=Digikey; ComponentLink4URL: https://datasheet.ciiva.com/2453/pyu-r-int-thick-7-2453120.pdf?src-supplier=Digikey; ComponentLink4Description: https://datasheet.ciiva.com/2453/pyu-r-int-thick-7-2453120.pdf?src-supplier=Digikey; ComponentLink5URL: http://www.mouser.com/ds/2/447/RC0603-272842.pdf?src-supplier=Mouser; ComponentLink5Description: http://www.mouser.com/ds/2/447/RC0603-272842.pdf?src-supplier=Mouser; ComponentLink6URL: http://www.yageo.com/documents/recent/PYu-RC_Group_51_RoHS_L_2.pdf?src-supplier=Avnet; ComponentLink6Description: http://www.yageo.com/documents/recent/PYu-RC_Group_51_RoHS_L_2.pdf?src-supplier=Avnet; ComponentLink7URL: http://www.yageo.com.tw/exep/pages/download/literatures/PYu-R_INT-thick_7.pdf?src-supplier=Digikey; ComponentLink7Description: http://www.yageo.com.tw/exep/pages/download/literatures/PYu-R_INT-thick_7.pdf?src-supplier=Digikey
R9 = RES 6.65M 0603: Res Thick Film 0603 6.65M Ohm 1% 0.1W(1/10W) ±200ppm/C Pad SMD T/R Automotive AEC-Q200; Manufacturer: Stackpole Electronics; Manufacturer Part Number: RMCF0603FT6M65; Power Dissipation: 100mW; Temperature Coefficient: 200ppm/°C; Voltage Rating: 75V; Supplier: DigiKey; Supplier Part Number: RMCF0603FT6M65CT-ND; RoHS: Compliant; Category: Chip SMD Resistors; Stock: 9210; Pricing: 1=0.1, 10=0.024, 25=0.0176, 50=0.0142, 100=0.0116, 250=0.00892, 500=0.00746, 1000=0.00629 (USD); Case/Package: 0603; China RoHS: Non-Compliant; Composition: Thick Film; Contact Plating: Tin; Height: 450µm; Lifecycle Status: Production; Max Operating Temperature: 155°C; Min Operating Temperature: -55°C; Mounting Technology: Surface Mount; Number of Terminals: 2; Packaging: Tape & Reel; Power Rating: 100mW; Radiation Hardening: No; REACH SVHC: Yes; Tolerance: 1%; Width: 800µm; Working Voltage: 75V; ComponentLink1URL: https://datasheet.octopart.com:443/RMCF0603FT6M65-Stackpole-Electronics-datasheet-182148065.pdf?src-supplier=IHS; ComponentLink1Description: https://datasheet.octopart.com:443/RMCF0603FT6M65-Stackpole-Electronics-datasheet-182148065.pdf?src-supplier=IHS; ComponentLink2URL: https://datasheet.octopart.com:443/RMCF0603FT6M65-Stackpole-Electronics-datasheet-28504820.pdf?src-supplier=Future+Electronics; ComponentLink2Description: https://datasheet.octopart.com:443/RMCF0603FT6M65-Stackpole-Electronics-datasheet-28504820.pdf?src-supplier=Future+Electronics; ComponentLink3URL: https://datasheet.octopart.com:443/RMCF0603FT6M65-Stackpole-Electronics-datasheet-141193804.pdf?src-supplier=Master+Electronics; ComponentLink3Description: https://datasheet.octopart.com:443/RMCF0603FT6M65-Stackpole-Electronics-datasheet-141193804.pdf?src-supplier=Master+Electronics; ComponentLink4URL: https://datasheet.octopart.com:443/RMCF0603FT6M65-Stackpole-Electronics-datasheet-189104163.pdf?src-supplier=Master+Electronics; ComponentLink4Description: https://datasheet.octopart.com:443/RMCF0603FT6M65-Stackpole-Electronics-datasheet-189104163.pdf?src-supplier=Master+Electronics; ComponentLink5URL: https://datasheet.octopart.com:443/RMCF0603FT6M65-Stackpole-Electronics-datasheet-116606903.pdf?src-supplier=Master+Electronics; ComponentLink5Description: https://datasheet.octopart.com:443/RMCF0603FT6M65-Stackpole-Electronics-datasheet-116606903.pdf?src-supplier=Master+Electronics; ComponentLink6URL: https://datasheet.octopart.com:443/RMCF0603FT6M65-Stackpole-Electronics-datasheet-62091608.pdf?src-supplier=Stackpole+Electronics; ComponentLink6Description: https://datasheet.octopart.com:443/RMCF0603FT6M65-Stackpole-Electronics-datasheet-62091608.pdf?src-supplier=Stackpole+Electronics; ComponentLink7URL: https://datasheet.octopart.com:443/RMCF0603FT6M65-Stackpole-Electronics-datasheet-12534581.pdf?src-supplier=Stackpole+Electronics; ComponentLink7Description: https://datasheet.octopart.com:443/RMCF0603FT6M65-Stackpole-Electronics-datasheet-12534581.pdf?src-supplier=Stackpole+Electronics; ComponentLink8URL: https://datasheet.octopart.com:443/RMCF0603FT6M65-Stackpole-Electronics-datasheet-10788263.pdf?src-supplier=Stackpole+Electronics; ComponentLink8Description: https://datasheet.octopart.com:443/RMCF0603FT6M65-Stackpole-Electronics-datasheet-10788263.pdf?src-supplier=Stackpole+Electronics; ComponentLink9URL: http://sigma.octopart.com:80/15940719/materials_sheet/Stackpole-Electronics-RMCF0603FT6M65.pdf?src-supplier=Compliance+Statements; ComponentLink9Description: http://sigma.octopart.com:80/15940719/materials_sheet/Stackpole-Electronics-RMCF0603FT6M65.pdf?src-supplier=Compliance+Statements; ComponentLink10URL: http://sigma.octopart.com:80/141158212/rohs_statement/Stackpole-Electronics-RMCF0603FT6M65.pdf?src-supplier=Compliance+Statements; ComponentLink10Description: http://sigma.octopart.com:80/141158212/rohs_statement/Stackpole-Electronics-RMCF0603FT6M65.pdf?src-supplier=Compliance+Statements; ComponentLink11URL: http://sigma.octopart.com:80/141158211/reach_statement/Stackpole-Electronics-RMCF0603FT6M65.pdf?src-supplier=Compliance+Statements; ComponentLink11Description: http://sigma.octopart.com:80/141158211/reach_statement/Stackpole-Electronics-RMCF0603FT6M65.pdf?src-supplier=Compliance+Statements; Supplier 1: DigiKey; Supplier Part Number 1: RMCF0603FT6M65TR-ND
R10 = RES 4.75M 0603: Fixed Resistor, Metal Glaze/thick Film, 0.1W, 4750000ohm, 75V, 1% +/-Tol, 100ppm/Cel, Surface Mount, 0603; Manufacturer: Yageo; Manufacturer Part Number: RC0603FR-074M75L; Additional Feature: LASER TRIMMABLE; Power: 100mW; Rated Temperature: 70°C; Temperature Coefficient: 100ppm/°C; Package Height: 0.45mm; Package Length: 1.6mm; Package Width: 0.8mm; Supplier: Digikey; Supplier Part Number: 311-4.75MHRCT-ND; RoHS: Yes; Category: Chip SMD Resistors; Stock: 37378; Pricing: 1=0.1, 10=0.012, 50=0.0096, 100=0.0071, 500=0.00612, 1000=0.0051 (USD); Mounting Technology: Surface Mount; Pins: 2; Package Shape: Rectangular; Case/Package: 0603; Terminal Finish: Nickel; Min Operating Temperature: -55°C; Max Operating Temperature: 155°C; Tolerance: 1%; JESD-609 Code: e3; Resistor Type: FIXED RESISTOR; Construction: Chip; Package Style: SMTMeter; Packaging: Tape and Reel; Technology: METAL GLAZE/THICK FILM; Termination: Wraparound; Working Voltage: 75V; Reach SVHC Compliant: Yes; RoHS Compliant: Yes; ComponentLink1URL: https://datasheet.ciiva.com:443/pdfs/VipMasterIC/IC/YAGO/YAGO-S-A0008145938/YAGO-S-A0008145938-1.pdf?src-supplier=IHS+Markit; ComponentLink1Description: https://datasheet.ciiva.com:443/pdfs/VipMasterIC/IC/YAGO/YAGO-S-A0008145938/YAGO-S-A0008145938-1.pdf?src-supplier=IHS+Markit; ComponentLink2URL: https://datasheet.ciiva.com/2455/pyu-r-int-thick-7-2455038.pdf?src-supplier=Digikey; ComponentLink2Description: https://datasheet.ciiva.com/2455/pyu-r-int-thick-7-2455038.pdf?src-supplier=Digikey; ComponentLink3URL: https://datasheet.ciiva.com/2455/pyu-r-int-thick-7-2455039.pdf?src-supplier=Digikey; ComponentLink3Description: https://datasheet.ciiva.com/2455/pyu-r-int-thick-7-2455039.pdf?src-supplier=Digikey; ComponentLink4URL: https://datasheet.ciiva.com/2455/pyu-r-int-thick-7-2455040.pdf?src-supplier=Digikey; ComponentLink4Description: https://datasheet.ciiva.com/2455/pyu-r-int-thick-7-2455040.pdf?src-supplier=Digikey; Supplier 1: DigiKey; Supplier Part Number 1: 2019-RK73H1JTTD4754FCT-ND
R11 = RES 4.99M 0603: Fixed Resistor, Metal Glaze/thick Film, 0.1W, 4990000ohm, 75V, 1% +/-Tol, 100ppm/Cel, Surface Mount, 0603; Manufacturer: Yageo; Manufacturer Part Number: RC0603FR-074M99L; Additional Feature: LASER TRIMMABLE; Power: 100mW; Rated Temperature: 70°C; Temperature Coefficient: 100ppm/°C; Package Height: 0.45mm; Package Length: 1.6mm; Package Width: 0.8mm; Supplier: Digikey; Supplier Part Number: 13-RC0603FR-074M99LDKR-ND; RoHS: Yes; Category: Chip SMD Resistors; Stock: 585; Pricing: 1=0.1, 10=0.019, 50=0.0112, 100=0.0093, 500=0.00622, 1000=0.00532 (USD); Mounting Technology: Surface Mount; Pins: 2; Package Shape: Rectangular; Case/Package: 0603; Terminal Finish: Nickel; Min Operating Temperature: -55°C; Max Operating Temperature: 155°C; Tolerance: 1%; JESD-609 Code: e3; Resistor Type: FIXED RESISTOR; Construction: Chip; Package Style: SMTMeter; Packaging: Tape and Reel; Technology: METAL GLAZE/THICK FILM; Termination: Wraparound; Working Voltage: 75V; Reach SVHC Compliant: Yes; RoHS Compliant: Yes; ComponentLink1URL: https://datasheet.ciiva.com:443/pdfs/VipMasterIC/IC/YAGO/YAGO-S-A0008145938/YAGO-S-A0008145938-1.pdf?src-supplier=IHS+Markit; ComponentLink1Description: https://datasheet.ciiva.com:443/pdfs/VipMasterIC/IC/YAGO/YAGO-S-A0008145938/YAGO-S-A0008145938-1.pdf?src-supplier=IHS+Markit; ComponentLink2URL: http://www.mouser.com/ds/2/447/RC0603-272842.pdf?src-supplier=Mouser; ComponentLink2Description: http://www.mouser.com/ds/2/447/RC0603-272842.pdf?src-supplier=Mouser; ComponentLink3URL: http://www.yageo.com/documents/recent/PYu-RC_Group_51_RoHS_L_9.pdf?src-supplier=Digikey; ComponentLink3Description: http://www.yageo.com/documents/recent/PYu-RC_Group_51_RoHS_L_9.pdf?src-supplier=Digikey; ComponentLink4URL: http://www.yageo.com/documents/recent/PYu-RC0603_51_RoHS_L_7.pdf?src-supplier=Future+Electronics; ComponentLink4Description: http://www.yageo.com/documents/recent/PYu-RC0603_51_RoHS_L_7.pdf?src-supplier=Future+Electronics; ComponentLink5URL: http://www.yageo.com/documents/recent/PYu-RC_Group_51_RoHS_L_2.pdf?src-supplier=Avnet; ComponentLink5Description: http://www.yageo.com/documents/recent/PYu-RC_Group_51_RoHS_L_2.pdf?src-supplier=Avnet; ComponentLink6URL: https://datasheet.octopart.com/RC0603FR-074M99L-Yageo-datasheet-164759695.pdf?src-supplier=Future+Electronics; ComponentLink6Description: https://datasheet.octopart.com/RC0603FR-074M99L-Yageo-datasheet-164759695.pdf?src-supplier=Future+Electronics; ComponentLink7URL: https://datasheet.octopart.com/RC0603FR-074M99L-Yageo-datasheet-148775077.pdf?src-supplier=TME; ComponentLink7Description: https://datasheet.octopart.com/RC0603FR-074M99L-Yageo-datasheet-148775077.pdf?src-supplier=TME; Supplier 1: DigiKey; Supplier Part Number 1: 541-4.99MHCT-ND
U1 = MIC5350-SGYMT-TR: Linear Voltage Regulator IC Positive Fixed 2 Output 300mA, 500mA 8-TMLFÂ® (2x2); MF: Microchip; SnapEDA_Link: https://www.snapeda.com/parts/MIC5350-SGYMT-TR/Microchip/view-part/?ref=snap; Package: UFDFN-8 Microchip; Value: *; MP: MIC5350-SGYMT-TR; Check_prices: https://www.snapeda.com/parts/MIC5350-SGYMT-TR/Microchip/view-part/?ref=eda
U4 = BQ25570RGRR: Ultra Low power Harvester power Management IC with boost charger, and Nanopower Buck Converter; MF: Texas Instruments; Package: VQFN-20 Texas Instruments; Value: *; Purchase-URL: https://pricing.snapeda.com/search/part/BQ25570RGRR/?ref=eda; Availability: In Stock; MP: BQ25570RGRR; Check_prices: https://www.snapeda.com/parts/BQ25570RGRR/Texas+Instruments/view-part/?ref=eda; SnapEDA_Link: https://www.snapeda.com/parts/BQ25570RGRR/Texas+Instruments/view-part/?ref=snap; Price: None